# Altium schematic sheet modFOC-ABNenc.SchDoc: modFOC-ABNenc
size A4; Author: Mathias Giller; CompanyName: HTL St. Pölten; Address1: modFOC; DocumentNumber: 3; Revision: 2.0; SheetNumber: 3; SheetTotal: 7
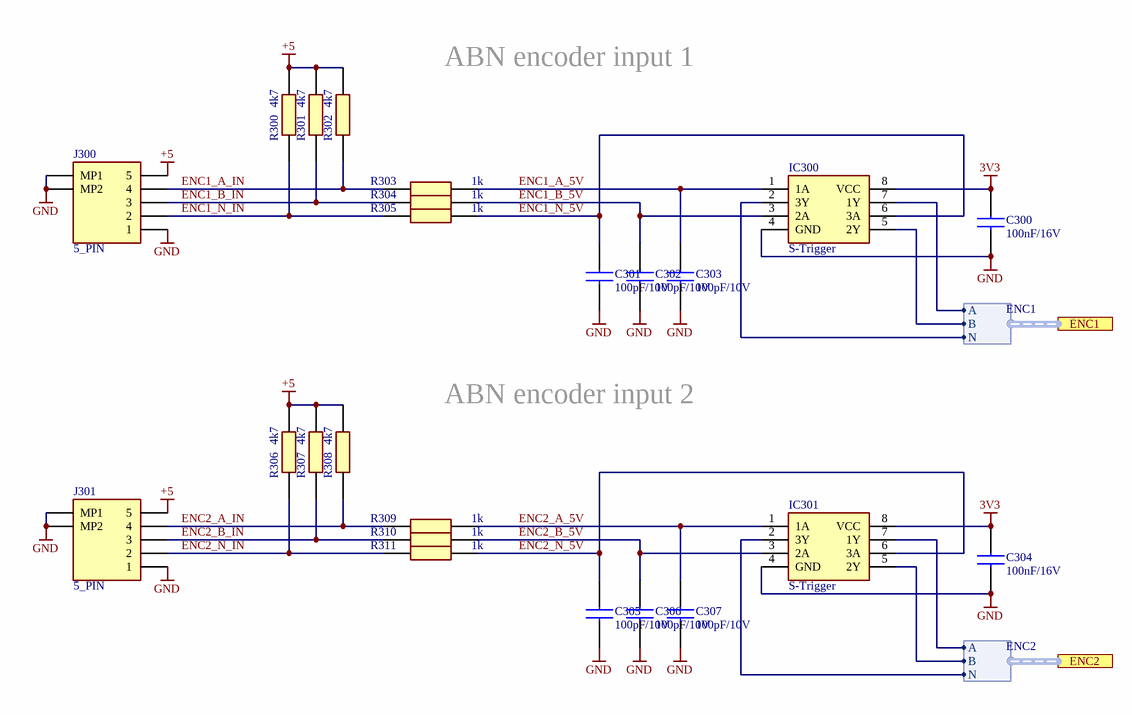
[diagram p0: modFOC-ABNenc.SchDoc]

## Parts
C300  100nF/16V  [CAPC1608X97N]
C301  100pF/10V  [CAPC1608X97N]
C302  100pF/10V  [CAPC1608X97N]
C303  100pF/10V  [CAPC1608X97N]
C304  100nF/16V  [CAPC1608X97N]
C305  100pF/10V  [CAPC1608X97N]
C306  100pF/10V  [CAPC1608X97N]
C307  100pF/10V  [CAPC1608X97N]
IC300  S-Trigger  [SOP65P400X110-8N]
IC301  S-Trigger  [SOP65P400X110-8N]
J300  5_PIN  [DF13A5P125H21]
J301  5_PIN  [DF13A5P125H21]
R300  4k7  [RESC1608X55N]
R301  4k7  [RESC1608X55N]
R302  4k7  [RESC1608X55N]
R303  1k  [RESC1608X55N]
R304  1k  [RESC1608X55N]
R305  1k  [RESC1608X55N]
R306  4k7  [RESC1608X55N]
R307  4k7  [RESC1608X55N]
R308  4k7  [RESC1608X55N]
R309  1k  [RESC1608X55N]
R310  1k  [RESC1608X55N]
R311  1k  [RESC1608X55N]

## Ports
ENC1 (harness ENC1), ENC2 (harness ENC2)

## Harnesses
ENC1: N, B, A
ENC2: A, B, N

## Nets
3V3: C300.2 C304.2 IC300.8(VCC) IC301.8(VCC)
+5: J300.5 J301.5 R300.2 R301.2 R302.2 R306.2 R307.2 R308.2
GND: C300.1 C301.2 C302.2 C303.2 C304.1 C305.2 C306.2 C307.2 IC300.4(GND) IC301.4(GND) J300.1 J300.MP1 J300.MP2 J301.1 J301.MP1 J301.MP2
ENC1_A_5V: C303.1 IC300.1(1A) R303.1
ENC1_A_IN: J300.4 R302.1 R303.2
ENC1_B_5V: C302.1 IC300.3(2A) R304.1
ENC1_B_IN: J300.3 R301.1 R304.2
ENC1_N_5V: C301.1 IC300.6(3A) R305.1
ENC1_N_IN: J300.2 R300.1 R305.2
ENC2_A_5V: C307.1 IC301.1(1A) R309.1
ENC2_A_IN: J301.4 R308.1 R309.2
ENC2_B_5V: C306.1 IC301.3(2A) R310.1
ENC2_B_IN: J301.3 R307.1 R310.2
ENC2_N_5V: C305.1 IC301.6(3A) R311.1
ENC2_N_IN: J301.2 R306.1 R311.2
NetIC300_2: IC300.2(3Y) ; port ENC1.N
NetIC300_5: IC300.5(2Y) ; port ENC1.B
NetIC300_7: IC300.7(1Y) ; port ENC1.A
NetIC301_2: IC301.2(3Y) ; port ENC2.N
NetIC301_5: IC301.5(2Y) ; port ENC2.B
NetIC301_7: IC301.7(1Y) ; port ENC2.A

## Notes on the sheet
- ABN encoder input 1
- ABN encoder input 2
- Title
- Size:
- Date:
- A4
- Number:
- Time:
- Revision:
- Sheet
- of
- File:

## Library data of the parts
C300-C307 = C0603: Capacitor
IC300 IC301 = 74LVC3G17DP,125: 3x Schmitt trigger; Manufacturer_Name: Nexperia; Datasheet Link: https://assets.nexperia.com/documents/data-sheet/74LVC3G17.pdf; Height: 1.1mm; Manufacturer_Part_Number: 74LVC3G17DP,125; Mouser Part Number: 771-LVC3G17DP125; Mouser Price/Stock: https://www.mouser.co.uk/ProductDetail/Nexperia/74LVC3G17DP125?qs=me8TqzrmIYUUngWcw0uHGA%3D%3D; Arrow Part Number: 74LVC3G17DP,125; Arrow Price/Stock: https://www.arrow.com/en/products/74lvc3g17dp125/nexperia
J300 J301 = DF13A-5P-1.25H_21_: Connector; Manufacturer_Name: Hirose; Manufacturer_Part_Number: DF13A-5P-1.25H(21); Datasheet Link: https://componentsearchengine.com/Datasheets/1/DF13A-5P-1.25H(21).pdf; Height: 3.75mm; Mouser Part Number: 798-DF13A5P125H21; Mouser Price/Stock: https://www.mouser.co.uk/ProductDetail/Hirose-Connector/DF13A-5P-125H21?qs=XQjbzJWzFPWvJsE2o%252B4Q8Q%3D%3D
R300-R311 = R0603: Resistor